# EAGLE design PICSOIC8 (EAGLE 9.6.2)
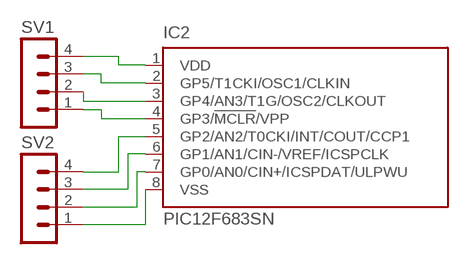
[diagram p0: schematic, sheet 1]

## Parts
IC2  PIC12F683SN  [SO-08]
SV1  MA04-1  [MA04-1]
SV2  MA04-1  [MA04-1]

## Nets
N$1: IC2.1(VDD) SV1.4
N$2: IC2.2(GP5/T1CKI/OSC1/CLKIN) SV1.3
N$3: IC2.3(GP4/AN3/T1G/OSC2/CLKOUT) SV1.2
N$4: IC2.4(GP3/!MCLR!/VPP) SV1.1
N$5: IC2.5(GP2/AN2/T0CKI/INT/COUT/CCP1) SV2.4
N$6: IC2.6(GP1/AN1/CIN-/VREF/ICSPCLK) SV2.3
N$7: IC2.7(GP0/AN0/CIN+/ICSPDAT/ULPWU) SV2.2
N$8: IC2.8(VSS) SV2.1

## Library data of the parts
IC2 = microchip:PIC12F683: 8-Pin Flash-Based, 8-Bit CMOS Microcontrollers with nanoWatt Technology Source: http://ww1.microchip.com/downloads/en/DeviceDoc/41211D_.pdf; MF: MICROCHIP; MPN: PIC12F683-I/SN; OC_FARNELL: 9759042; OC_NEWARK: 61K3434
SV1 SV2 = con-lstb:MA04-1: PIN HEADER; OC_FARNELL: unknown; OC_NEWARK: unknown

## Board
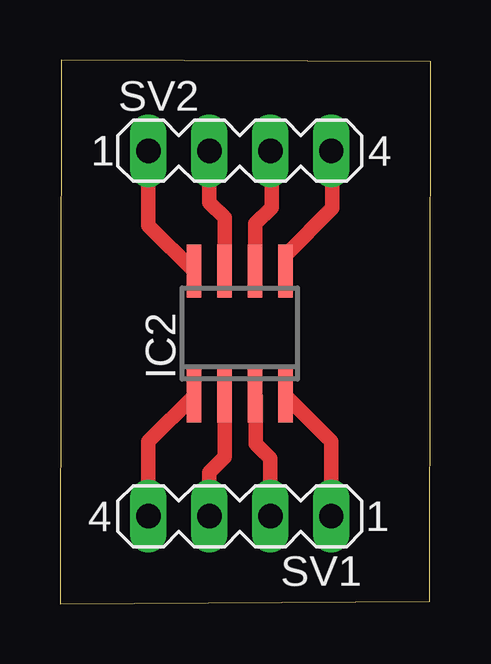
[diagram p1: board, top side]

Size 15.45 x 22.68 mm. Coordinates in mm from the lower left corner, seen from the top.
Outline: 0,0 15.4,0.1 15.45,22.61 0.05,22.68 0,0
Copper layers (1*16): Top 0.035mm / dielectric 1.5mm / Bottom 0.035mm
Design rules "default": minimum track width 6mil, minimum drill 0.35mm, track to track 6mil, track to pad 6mil, pad to pad 6mil, via to via 6mil, smd to smd 6mil, copper to edge 40mil, drill to drill 6mil, minimum pad ring 10mil, minimum via ring 8mil, stop-mask expansion 4mil, vias tented up to drill 0mil, thermal gap 10mil

### Footprints (pad centres in the part's own frame; a part is rotated, then mirrored left to right if it is on the bottom)
SO-08 = smd 0.6 x 2.2: 1 -1.905,-2.6; 2 -0.635,-2.6; 3 0.635,-2.6; 4 1.905,-2.6; 5 1.905,2.6; 6 0.635,2.6; 7 -0.635,2.6; 8 -1.905,2.6
MA04-1 = drill 1.016 long: 1 -3.81,0; 2 -1.27,0; 3 1.27,0; 4 3.81,0

### Placement (x,y rotation side)
IC2  7.49,11.28 0 top
SV1  7.49,3.66 180 top
SV2  7.49,18.9 0 top

### Tracks (layer width: path | path; a pad name or v marks a point on that pad's centre or on a via)
N$1
  Top 0.61: SV1.4 3.68,6.77 IC2.1
N$2
  Top 0.61: SV1.3 6.22,5.49 6.86,6.12 IC2.2
N$3
  Top 0.61: SV1.2 8.76,6.07 8.15,6.68 8.15,8.65 IC2.3
N$4
  Top 0.61: SV1.1 11.3,6.77 IC2.4
N$5
  Top 0.61: IC2.5 9.4,14.55 11.35,16.51 11.35,18.85 SV2.4
N$6
  Top 0.61: IC2.6 8.13,15.85 8.81,16.54 8.81,18.85 SV2.3
N$7
  Top 0.61: IC2.7 6.86,16.1 6.22,16.74 SV2.2
N$8
  Top 0.61: IC2.8 3.68,15.78 SV2.1